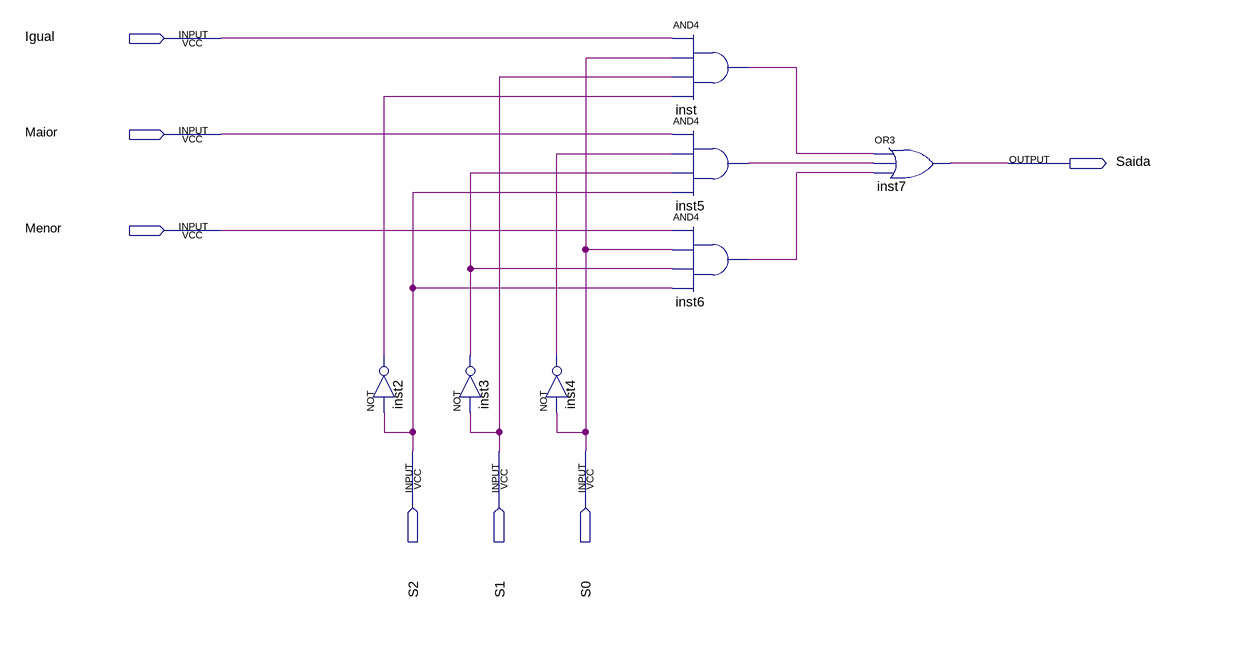
[diagram p0: schematic sheet]
// Quartus schematic mux_1bit.bdf as structural Verilog: 7 symbols, 7 pins
module mux_1bit (
  input  Igual,
  input  Maior,
  input  Menor,
  input  S2,
  input  S1,
  input  S0,
  output Saida
);

  wire inst2_out, inst3_out, inst4_out, inst5_out, inst6_out, inst_out;

  not inst2 (inst2_out, S2);
  not inst3 (inst3_out, S1);
  not inst4 (inst4_out, S0);
  and inst (inst_out, Igual, S0, S1, inst2_out);
  and inst5 (inst5_out, Maior, inst4_out, inst3_out, S2);
  and inst6 (inst6_out, Menor, S0, inst3_out, S2);
  or inst7 (Saida, inst_out, inst5_out, inst6_out);
endmodule
